# Altium schematic sheet radio-power.SchDoc
size Letter; CompanyName: Signal Laboratories, Inc.; Address1: 3479 Edison Way; Address2: Menlo Park CA 94025; Address3: +1 (877) 778-8435; Address4: siglabs.com; Revision: 1; SheetNumber: 1; SheetTotal: 1
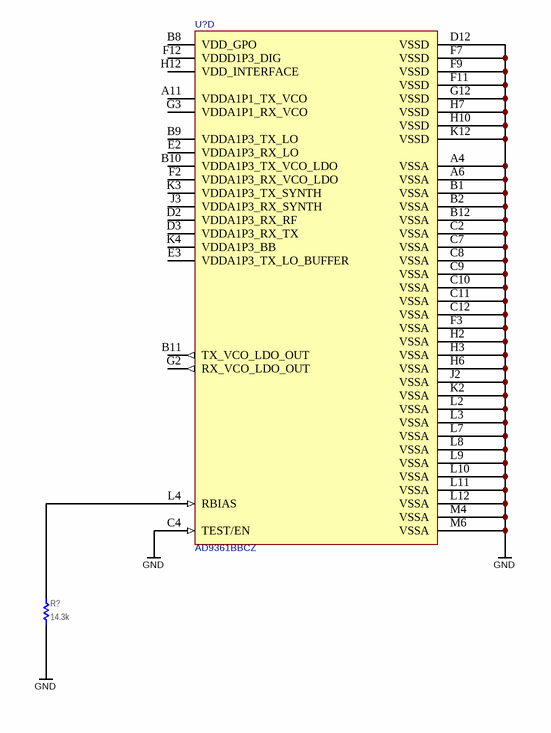
[diagram p0: radio-power.SchDoc]

## Parts
R?  value 14.3k  [RESC1005X40N]  (hidden comment: ERJ-2RKF1432X)
U?  AD9361BBCZ  [BGA144C80P12X12_1000X1000X170_AD9361BBCZ(Primary)]  (part D of 4)

## Nets
GND: R?.2 U?.A4(VSSA) U?.A6(VSSA) U?.B1(VSSA) U?.B2(VSSA) U?.B12(VSSA) U?.C2(VSSA) U?.C4(TEST/EN) U?.C7(VSSA) U?.C8(VSSA) U?.C9(VSSA) U?.C10(VSSA) U?.C11(VSSA) U?.C12(VSSA) U?.D12(VSSD) U?.F3(VSSA) U?.F7(VSSD) U?.F9(VSSD) U?.F11(VSSD) U?.G12(VSSD) U?.H2(VSSA) U?.H3(VSSA) U?.H6(VSSA) U?.H7(VSSD) U?.H10(VSSD) U?.J2(VSSA) U?.K2(VSSA) U?.K12(VSSD) U?.L2(VSSA) U?.L3(VSSA) U?.L7(VSSA) U?.L8(VSSA) U?.L9(VSSA) U?.L10(VSSA) U?.L11(VSSA) U?.L12(VSSA) U?.M4(VSSA) U?.M6(VSSA)
NetR?_1: R?.1 U?.L4(RBIAS)

Not connected (* = marked no-connect by the designer): U? A11(VDDA1P1_TX_VCO) B8(VDD_GPO) B9(VDDA1P3_TX_LO) B10(VDDA1P3_TX_VCO_LDO) B11(TX_VCO_LDO_OUT) D2(VDDA1P3_RX_RF) D3(VDDA1P3_RX_TX) E2(VDDA1P3_RX_LO) E3(VDDA1P3_TX_LO_BUFFER) F2(VDDA1P3_RX_VCO_LDO) F12(VDDD1P3_DIG) G2(RX_VCO_LDO_OUT) G3(VDDA1P1_RX_VCO) H12(VDD_INTERFACE) J3(VDDA1P3_RX_SYNTH) K3(VDDA1P3_TX_SYNTH) K4(VDDA1P3_BB)

## Notes on the sheet
- Title
- Engineer
- Revision
- Drawn By
- Checked By
- Date
- Sheet
- of

## Library data of the parts
R? = RES: Thick Film Resistor 14.3k ±1% 0.1W 75V 0402; Manufacturer: Panasonic; Tcr: ±100; Tr: -55:155; Voltage: 75; Power: 0.1; Tolerance: ±1%; Manufacturer P/N: ERJ-2RKF1432X; Alternatives: *; Footprint: *; Package: 0402
U? = AD9361: RF Agile Transceiver